# Altium schematic sheet Big Coil Gate Drive PCBA.SchDoc
size A4
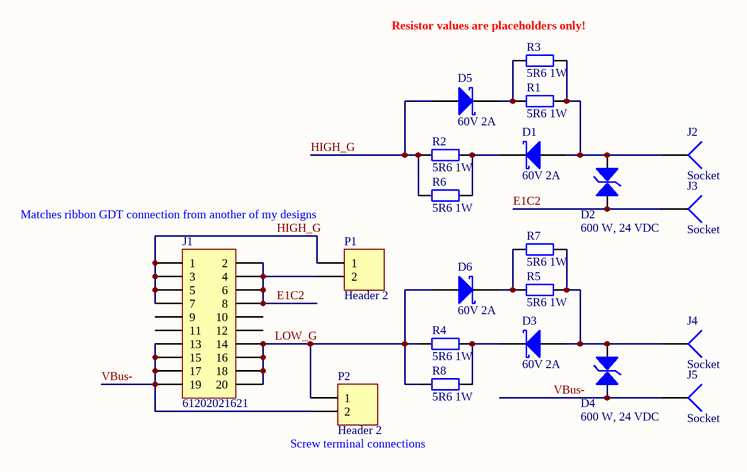
[diagram p0: Big Coil Gate Drive PCBA.SchDoc]

## Parts
D1  60V 2A  [DO-214AA_(SMB-J-BEND)_UNI]
D2  600 W, 24 VDC  [DO-214AA_Bidirectional]
D3  60V 2A  [DO-214AA_(SMB-J-BEND)_UNI]
D4  600 W, 24 VDC  [DO-214AA_Bidirectional]
D5  60V 2A  [DO-214AA_(SMB-J-BEND)_UNI]
D6  60V 2A  [DO-214AA_(SMB-J-BEND)_UNI]
J1  61202021621  [61202021621]
J2  Socket  [Keystone3534]
J3  Socket  [Keystone3534]
J4  Socket  [Keystone3534]
J5  Socket  [Keystone3534]
P1  Header 2  [691213510002]
P2  Header 2  [691213510002]
R1  value 5R6 1W  [RES_2512]  (hidden comment: Res2)
R2  value 5R6 1W  [RES_2512]  (hidden comment: Res2)
R3  value 5R6 1W  [RES_2512]  (hidden comment: Res2)
R4  value 5R6 1W  [RES_2512]  (hidden comment: Res2)
R5  value 5R6 1W  [RES_2512]  (hidden comment: Res2)
R6  value 5R6 1W  [RES_2512]  (hidden comment: Res2)
R7  value 5R6 1W  [RES_2512]  (hidden comment: Res2)
R8  value 5R6 1W  [RES_2512]  (hidden comment: Res2)

## Nets
E1C2: D2.2 J1.2 J1.4 J1.6 J1.8 J3.1 P1.2
HIGH_G: D5.A J1.1 J1.3 J1.5 J1.7 P1.1 R2.1 R6.1
LOW_G: D6.A J1.14 J1.16 J1.18 J1.20 P2.1 R4.1 R8.1
VBus-: D4.2 J1.13 J1.15 J1.17 J1.19 J5.1 P2.2
NetD1_A: D1.A D2.1 J2.1 R1.2 R3.2
NetD1_K: D1.K R2.2 R6.2
NetD3_A: D3.A D4.1 J4.1 R5.2 R7.2
NetD3_K: D3.K R4.2 R8.2
NetD5_K: D5.K R1.1 R3.1
NetD6_K: D6.K R5.1 R7.1

Not connected (* = marked no-connect by the designer): J1 9 10 11 12

## Notes on the sheet
- (near R3) Resistor values are placeholders only!
- Matches ribbon GDT connection from another of my designs
- (near P2) Screw terminal connections

## Library data of the parts
D1 D3 D5 D6 = SS26: SS26 Schottky rectifier
D2 D4 = WE-TVSP DO-214AA, 824521241: WE-TVSP Power TVS Diode, bidirectional, 600 W, 24 VDC; Manufacturer: Wurth Elektronik; partNo: 824521241; ComponentLink1Description: Manufacturer; ComponentLink1URL: http://www.we-online.de; Created by: Baojun Chen; Created Date: Nov.2015; ComponentLink2Description: Datasheet; ComponentLink2URL: http://katalog.we-online.de/pbs/datasheet/824521241.pdf
J1 = 61202021621: WR-BHD 2.54mm Male Box Header; Manufacturer: Wurth Elektronik; ComponentLink1 Description: Manufacturer; ComponentLink2 Description: Datasheet; NoPins: 20; Created Date: March 2016; partNo: 61202021621; ComponentLink1URL: http://www.we-online.com; ComponentLink2URL: http://katalog.we-online.de/em/datasheet/6120xx21621.pdf; Created by: Baojun Chen
P1 P2 = Header 2: Header, 2-Pin; LatestRevisionDate: 17-Jul-2002; LatestRevisionNote: Re-released for DXP Platform.; Publisher: Altium Limited
R1-R8 = Res2: Resistor; Published: 8-Jun-2000; LatestRevisionDate: 17-Jul-2002; LatestRevisionNote: Re-released for DXP Platform.; PackageReference: AXIAL-0.4; Publisher: Altium Limited; PackageDescription: Axial Device, Thru-Hole; 2 Leads; 0.4 in Pin Spacing
J2-J5 = Socket: LatestRevisionDate: 17-Jul-2002; LatestRevisionNote: Re-released for DXP Platform.; Publisher: Altium Limited